# Altium schematic sheet RADIO.SchDoc
size A; SheetNumber: 4; SheetTotal: 10
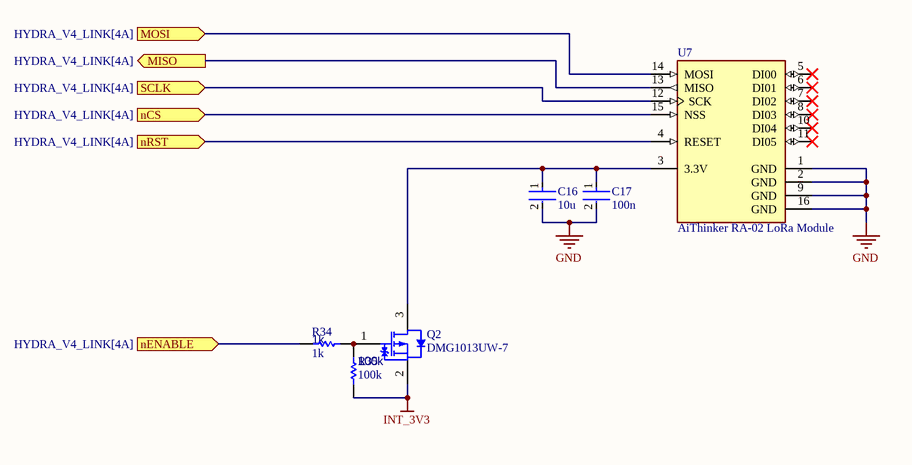
[diagram p0: RADIO.SchDoc]

## Parts
C16  10u  [FP-0402-L_1_0_0_05-W_0_5-IPC_A]
C17  100n  [FP-0402-L_1_0_0_05-W_0_5-IPC_A]
Q2  DMG1013UW-7  [DIOD-SOT323-3_V]
R34  1k  [R0603B]
R35  100k  [R0603B]
U7  AiThinker RA-02 LoRa Module  [AiThinker RA-02 LoRa Module-Footprint-1]

## Ports
MISO (out, see HYDRA_V4_LINK[4A]), MOSI (in, see HYDRA_V4_LINK[4A]), nCS (in, see HYDRA_V4_LINK[4A]), nENABLE (in, see HYDRA_V4_LINK[4A]), nRST (in, see HYDRA_V4_LINK[4A]), SCLK (in, see HYDRA_V4_LINK[4A])

## Nets
GND: C16.2 C17.2 U7.1(GND) U7.2(GND) U7.9(GND) U7.16(GND)
INT_3V3: Q2.2(S) R35.2
MISO: U7.13(MISO) ; port MISO
MOSI: U7.14(MOSI) ; port MOSI
nCS: U7.15(NSS) ; port nCS
nENABLE: R34.1 ; port nENABLE
nRST: U7.4(RESET) ; port nRST
SCLK: U7.12(SCK) ; port SCLK
NetC16_1: C16.1 C17.1 Q2.3(D) U7.3(3.3V)
NetQ2_1: Q2.1(G) R34.2 R35.1

Not connected (* = marked no-connect by the designer): U7 5(DI00)* 6(DI01)* 7(DI02)* 8(DI03)* 10(DI04)* 11(DI05)*

## Library data of the parts
C16 C17 = CMP-001-00058-1: LARGE PADS, 0402 CAP, CHANGE COMMENT TO MATCH REAL P/N; Capacitor Type: Ceramic; Min Operating Temperature: -55°C; Mounting Technology: Surface Mount; Pins: 2; Case/Package: 0402; RoHS Compliant: Yes; Max Operating Temperature: 85°C
  C16: Value: 10u
  C17: Value: 100n
Q2 = CMP-2000-06170-1: P-Channel Enhancement Mode MOSFET, 310 mW, 20 V, -55 to 150 degC, 3-Pin SOT-323, RoHS, Tape and Reel; Manufacturer: Diodes Inc; Qg Gate Charge: 0.622nC; Drain-Source On Resistance-Max: 750mO; Rated Power Dissipation: 310mW; Drain-to-Source Voltage [Vdss]: 20V; Package Reference: SOT323; Datasheet Version: Rev. 3-2, 09/2013; Package Description: 3-Pin Small Outline Transistor, Body 2 x 1.25 mm, Pitch 0.65 mm; Mounting Technology: SurfaceMount; Manufacturer URL: http://www.diodes.com/; Datasheet URL: http://www.diodes.com/_files/datasheets/ds31861.pdf; Channel Type: P-Channel
R34 R35 = CMP-009-00002-14: Resistor
  R34: Value: 1k
  R35: Value: 100k
U7 = CMP-021-00000-1